# Altium project RC_receiver_Zenith.PrjPcb
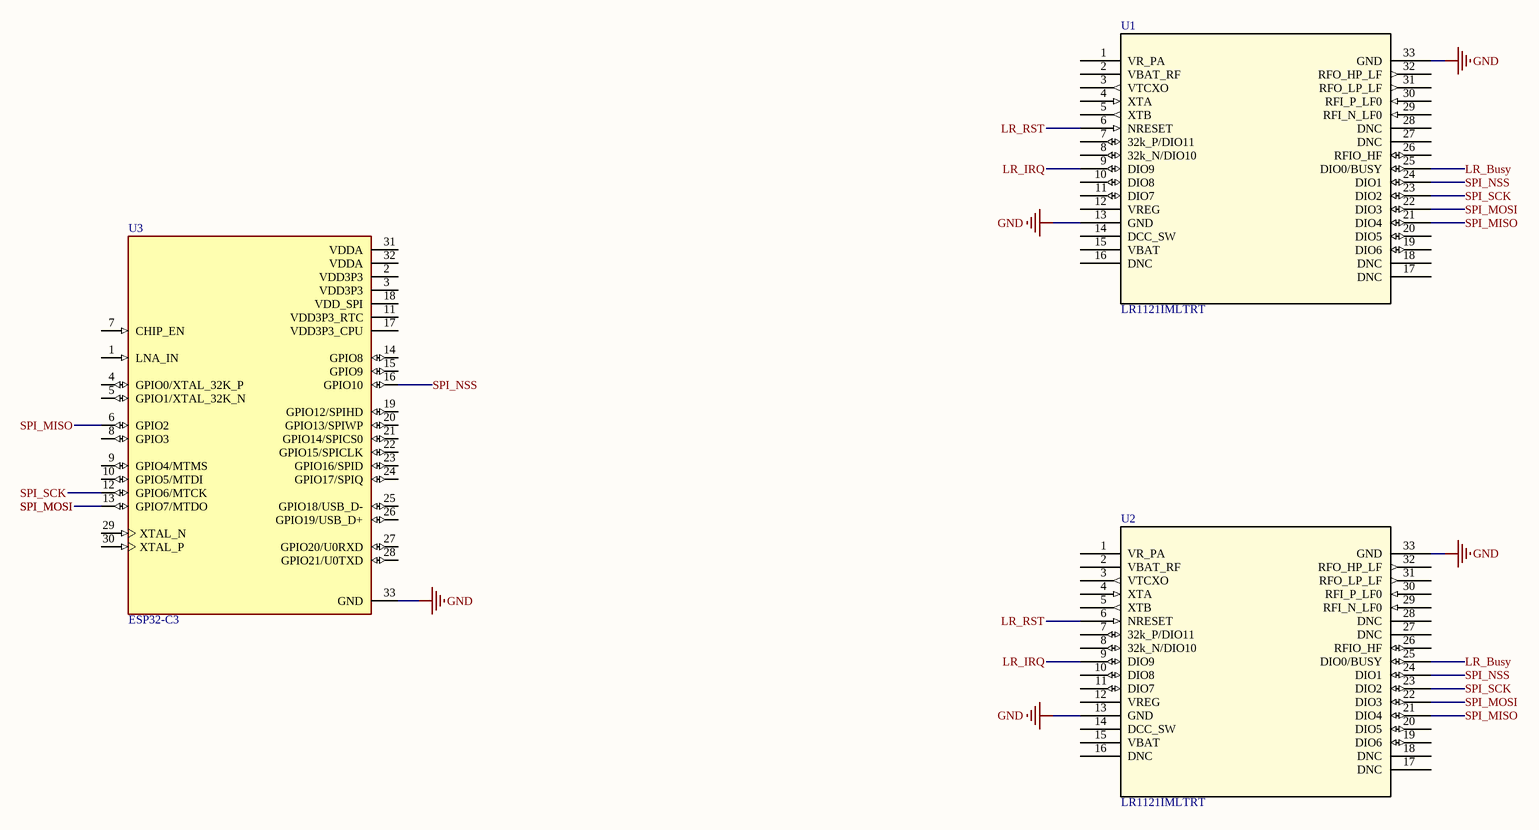
[diagram p0: schémaV1.SchDoc]
1 sheet, 3 parts. Net scope: global (net labels, ports and power ports of the same name join across sheets).

## Sheet schémaV1.SchDoc
size A3; SheetNumber: 1; SheetTotal: 1

### Parts
U1  LR1121IMLTRT  [QFN32_5X5_MLP_SEM]
U2  LR1121IMLTRT  [QFN32_5X5_MLP_SEM]
U3  ESP32-C3  [QFN50P500X500X90-33N]

### Nets
GND: U1.13(GND) U1.33(GND) U2.13(GND) U2.33(GND) U3.33(GND)
LR_Busy: U1.25(DIO0/BUSY) U2.25(DIO0/BUSY)
LR_IRQ: U1.9(DIO9) U2.9(DIO9)
LR_RST: U1.6(NRESET) U2.6(NRESET)
SPI_MISO: U1.21(DIO4) U2.21(DIO4) U3.6(GPIO2)
SPI_MOSI: U1.22(DIO3) U2.22(DIO3) U3.13(GPIO7/MTDO)
SPI_NSS: U1.24(DIO1) U2.24(DIO1) U3.16(GPIO10)
SPI_SCK: U1.23(DIO2) U2.23(DIO2) U3.12(GPIO6/MTCK)

Not connected (* = marked no-connect by the designer): U1 1(VR_PA) 2(VBAT_RF) 3(VTCXO) 4(XTA) 5(XTB) 7(32k_P/DIO11) 8(32k_N/DIO10) 10(DIO8) 11(DIO7) 12(VREG) 14(DCC_SW) 15(VBAT) 16(DNC) 17(DNC) 18(DNC) 19(DIO6) 20(DIO5) 26(RFIO_HF) 27(DNC) 28(DNC) 29(RFI_N_LF0) 30(RFI_P_LF0) 31(RFO_LP_LF) 32(RFO_HP_LF); U2 1(VR_PA) 2(VBAT_RF) 3(VTCXO) 4(XTA) 5(XTB) 7(32k_P/DIO11) 8(32k_N/DIO10) 10(DIO8) 11(DIO7) 12(VREG) 14(DCC_SW) 15(VBAT) 16(DNC) 17(DNC) 18(DNC) 19(DIO6) 20(DIO5) 26(RFIO_HF) 27(DNC) 28(DNC) 29(RFI_N_LF0) 30(RFI_P_LF0) 31(RFO_LP_LF) 32(RFO_HP_LF); U3 1(LNA_IN) 2(VDD3P3) 3(VDD3P3) 4(GPIO0/XTAL_32K_P) 5(GPIO1/XTAL_32K_N) 7(CHIP_EN) 8(GPIO3) 9(GPIO4/MTMS) 10(GPIO5/MTDI) 11(VDD3P3_RTC) 14(GPIO8) 15(GPIO9) 17(VDD3P3_CPU) 18(VDD_SPI) 19(GPIO12/SPIHD) 20(GPIO13/SPIWP) 21(GPIO14/SPICS0) 22(GPIO15/SPICLK) 23(GPIO16/SPID) 24(GPIO17/SPIQ) 25(GPIO18/USB_D-) 26(GPIO19/USB_D+) 27(GPIO20/U0RXD) 28(GPIO21/U0TXD) 29(XTAL_N) 30(XTAL_P) 31(VDDA) 32(VDDA)

### Library data of the parts
U1 U2 = LR1121IMLTRT: Description; Manufacturer_Name: Semtech; Type: RF; Copyright: Copyright (C) 2025 Ultra Librarian. All rights reserved.; Manufacturer_Part_Number: LR1121IMLTRT; RefDes: RefDes
U3 = ESP32-C3: WiFi Modules (802.11) (Engineering Samples Only) SMD IC ESP32-C3, RISC-V single-core MCU, 2.4G Wi-Fi & BLE 5.0 combo, QFN 32-pin, 5*5 mm, 40 ~ 105C; MF: Espressif Systems; SnapEDA_Link: https://www.snapeda.com/parts/ESP32-C3/Espressif+Systems/view-part/?ref=snap; Package: VFQFN-32 Espressif Systems; Value: *; MP: ESP32-C3; Check_prices: https://www.snapeda.com/parts/ESP32-C3/Espressif+Systems/view-part/?ref=eda